# Altium schematic sheet brush_driver.SchDoc: Brush_Driver
size A3; CompanyName: BUPT; DrawnBy: BUPT_HCM; Organization: BUPT_Robot; Revision: A; SheetNumber: 1; SheetTotal: 1; Version: 4.1; LibVersion: 0
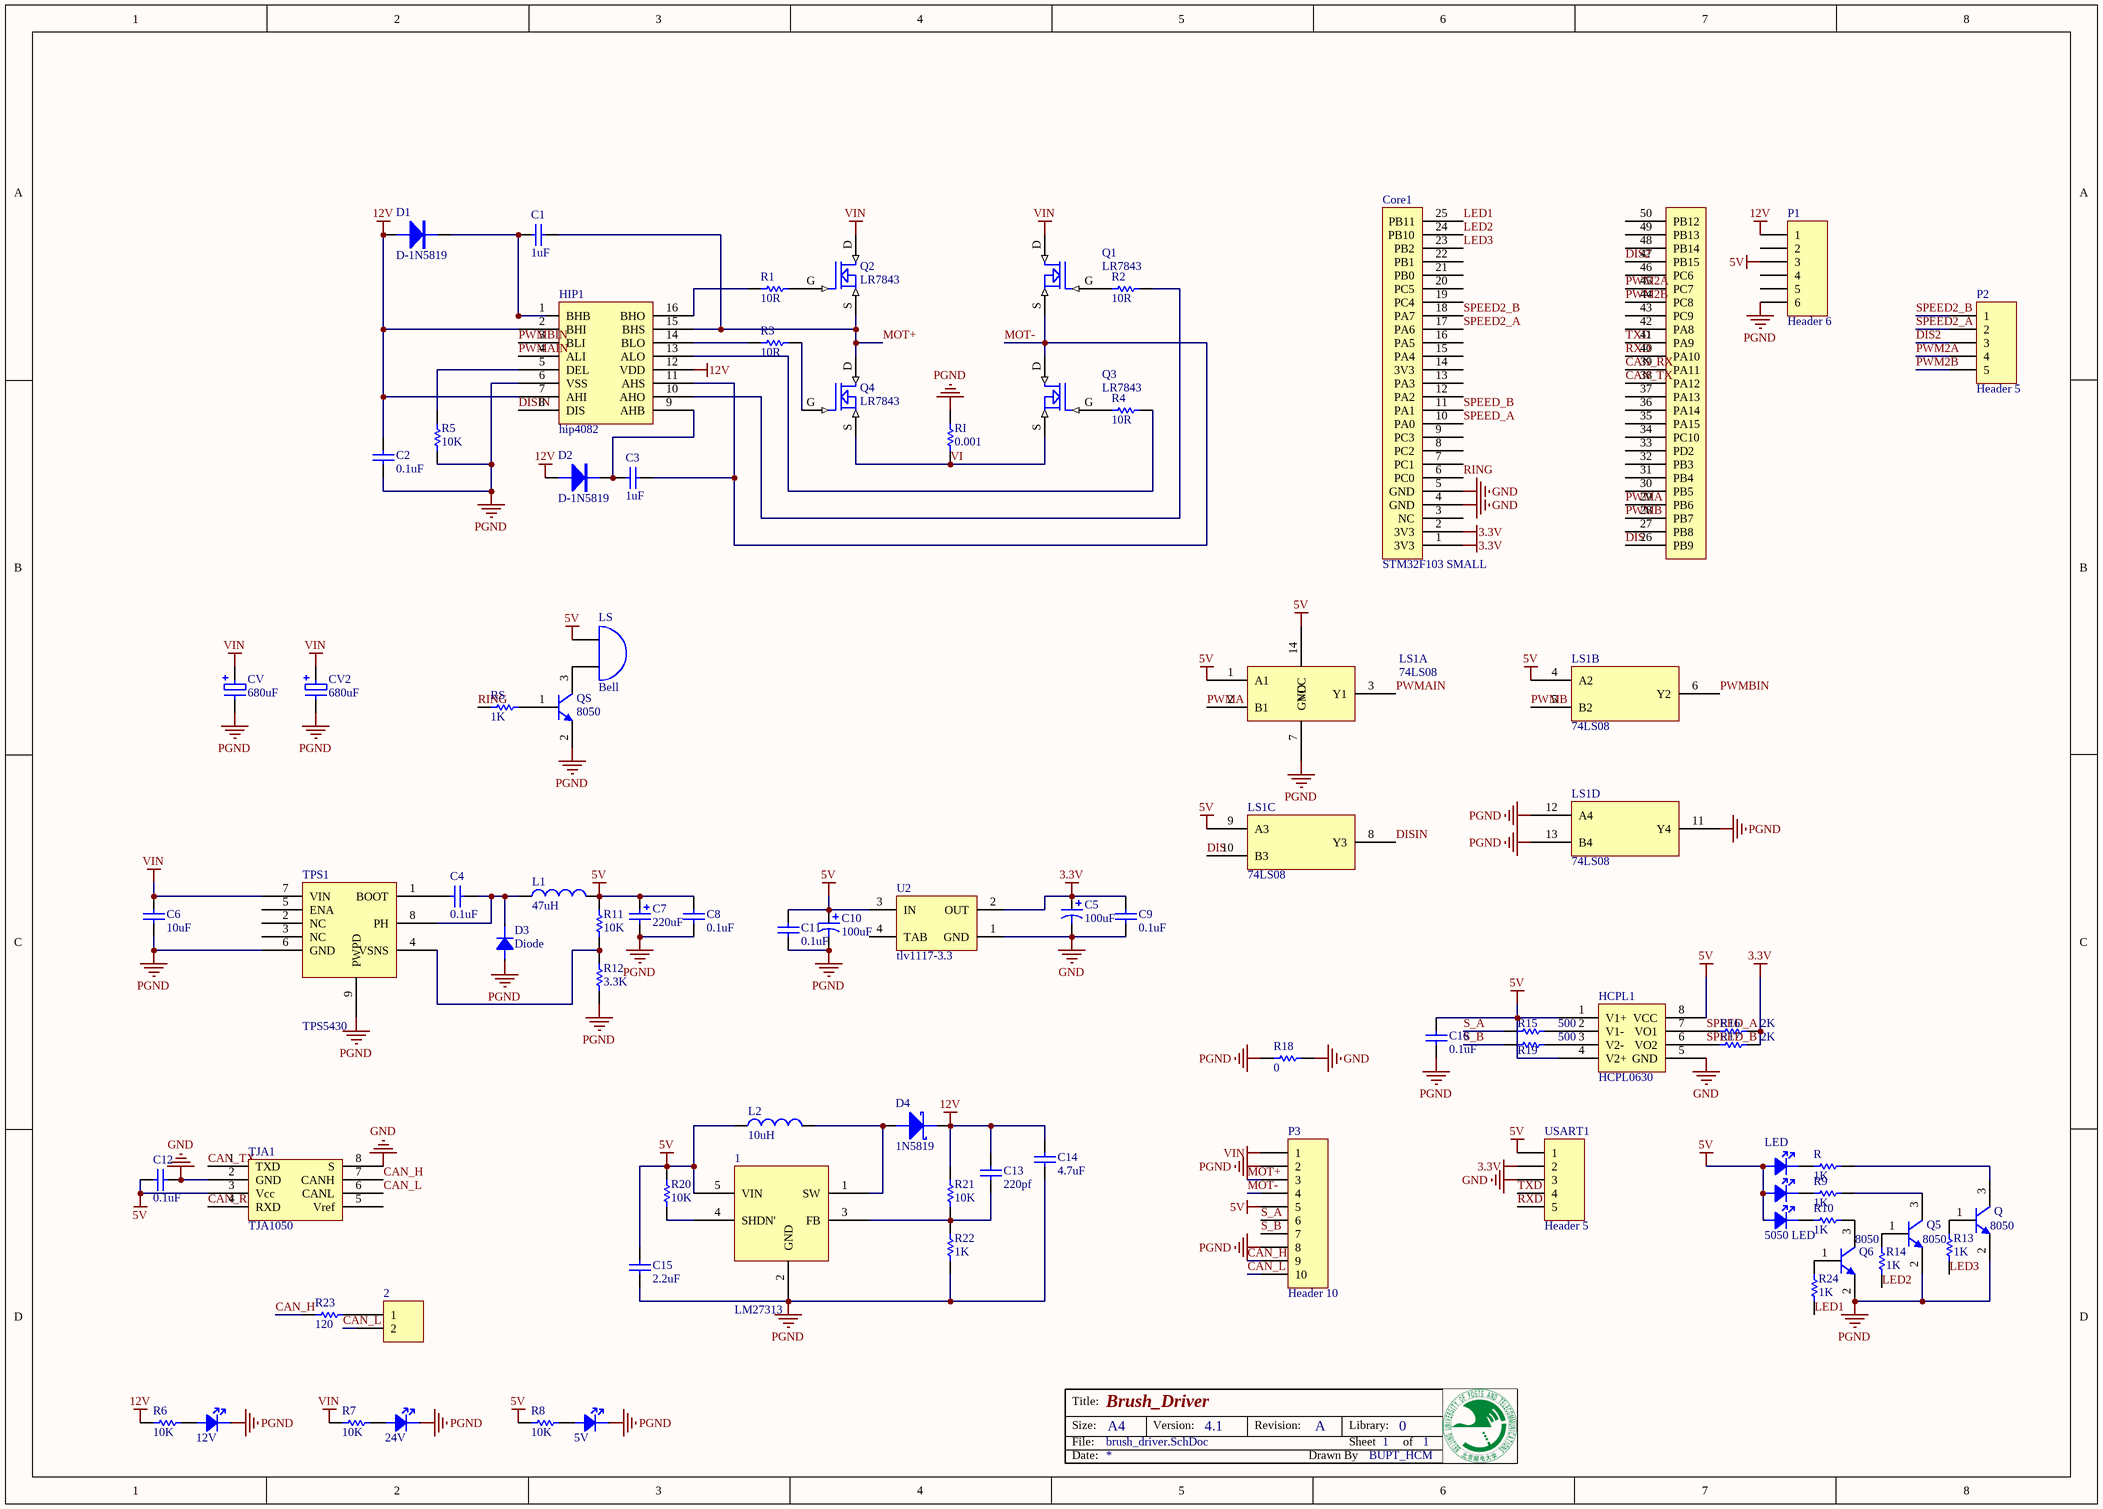
[diagram p0: brush_driver.SchDoc]

## Parts
1  LM27313  [LM27313]
2  Header 2  [SIP2]  (value not drawn)
5V  lED  [0805D]  (value not drawn)
12V  lED  [0805D]  (value not drawn)
24V  lED  [0805D]  (value not drawn)
C1  value 1uF  [CAP-MLCC-0603]  (hidden comment: Cap)
C2  value 0.1uF  [CAP-MLCC-0603]  (hidden comment: Cap)
C3  value 1uF  [CAP-MLCC-0603]  (hidden comment: Cap)
C4  value 0.1uF  [CAP-MLCC-0603]  (hidden comment: Cap)
C5  value 100uF  [6032C]  (hidden comment: Cap Pol3)
C6  value 10uF  [0805C]  (hidden comment: Cap)
C7  value 220uF  [CAP-TAN-7343/CAPD]  (hidden comment: Cap Pol1)
C8  value 0.1uF  [CAP-MLCC-0603]  (hidden comment: Cap)
C9  value 0.1uF  [CAP-MLCC-0603]  (hidden comment: Cap)
C10  value 100uF  [6032C]  (hidden comment: Cap Pol3)
C11  value 0.1uF  [CAP-MLCC-0603]  (hidden comment: Cap)
C12  value 0.1uF  [CAP-MLCC-0603]  (hidden comment: Cap)
C13  value 220pf  [CAP-MLCC-0603]  (hidden comment: Cap)
C14  value 4.7uF  [CAP-MLCC-0603]  (hidden comment: Cap)
C15  value 2.2uF  [CAP-MLCC-0603]  (hidden comment: Cap)
C16  value 0.1uF  [CAP-MLCC-0603]  (hidden comment: Cap)
Core1  STM32F103 SMALL  [STM32F103Small]
CV  680uF  [C_ELE]
CV2  680uF  [C_ELE]
D1  D-1N5819  [0805D]
D2  D-1N5819  [0805D]
D3  Diode  [SS34]
D4  1N5819  [0805D]
HCPL1  HCPL0630  [SOIC8]
HIP1  hip4082  [SOP16]
L1  value 47uH  [CD74]  (hidden comment: Inductor)
L2  value 10uH  [CD52]  (hidden comment: Inductor)
LED  5050 LED  [5050LED]
LS  Bell  [Ring]
LS1  74LS08  [SOJ-14]  (parts A,B,C,D of 4)
P1  Header 6  [HDR1X6]
P2  Header 5  [HDR1X5]
P3  Header 10  [Green 10P]
Q  8050  [SOT-23B_N]
Q1  LR7843  [LR7843]
Q2  LR7843  [LR7843]
Q3  LR7843  [LR7843]
Q4  LR7843  [LR7843]
Q5  8050  [SOT-23B_N]
Q6  8050  [SOT-23B_N]
QS  8050  [SOT-23B_N]
R  value 1K  [RES-0603]  (hidden comment: Res1)
R1  value 10R  [RES-0603]  (hidden comment: Res1)
R2  value 10R  [RES-0603]  (hidden comment: Res1)
R3  value 10R  [RES-0603]  (hidden comment: Res1)
R4  value 10R  [RES-0603]  (hidden comment: Res1)
R5  value 10K  [RES-0603]  (hidden comment: Res1)
R6  value 10K  [RES-0603]  (hidden comment: Res1)
R7  value 10K  [RES-0603]  (hidden comment: Res1)
R8  value 10K  [RES-0603]  (hidden comment: Res1)
R9  value 1K  [RES-0603]  (hidden comment: Res1)
R10  value 1K  [RES-0603]  (hidden comment: Res1)
R11  value 10K  [RES-0603]  (hidden comment: Res1)
R12  value 3.3K  [RES-0603]  (hidden comment: Res1)
R13  value 1K  [RES-0603]  (hidden comment: Res1)
R14  value 1K  [RES-0603]  (hidden comment: Res1)
R15  value 500  [RES-0603]  (hidden comment: Res1)
R16  value 2K  [RES-0603]  (hidden comment: Res1)
R17  value 2K  [RES-0603]  (hidden comment: Res1)
R18  value 0  [RES-0603]  (hidden comment: Res1)
R19  value 500  [RES-0603]  (hidden comment: Res1)
R20  value 10K  [RES-0603]  (hidden comment: Res1)
R21  value 10K  [RES-0603]  (hidden comment: Res1)
R22  value 1K  [RES-0603]  (hidden comment: Res1)
R23  value 120  [RES-0603]  (hidden comment: Res1)
R24  value 1K  [RES-0603]  (hidden comment: Res1)
RI  value 0.001  [2512R]  (hidden comment: Res1)
RS  value 1K  [RES-0603]  (hidden comment: Res1)
TJA1  TJA1050  [TJA1050]
TPS1  TPS5430  [TPS5430]
U2  tlv1117-3.3  [LM1117]
USART1  Header 5  [Green_5P]

## Nets
3.3V: C5.1 C9.1 Core1.1(3V3) Core1.2(3V3) R16.2 R17.2 U2.2(OUT) USART1.2
5V: 1.5(VIN) C7.1 C8.2 C10.1 C11.1 C12.1 C15.2 C16.1 HCPL1.1(V1+) HCPL1.4(V2+) HCPL1.8(VCC) L1.2 L2.1 LED.A1 LED.A2 LED.A3 LS.1(A) LS1.1(A1) LS1.4(A2) LS1.9(A3) LS1.14(VCC) P1.3 P3.5 R8.2 R11.2 R20.1 TJA1.3(Vcc) U2.3(IN) USART1.1
12V: C2.2 C13.2 C14.2 D1.A D2.A D4.K HIP1.2(BHI) HIP1.7(AHI) HIP1.12(VDD) P1.1 R6.2 R21.1
GND: C5.2 C9.2 C12.2 Core1.4(GND) Core1.5(GND) HCPL1.5(GND) R18.2 TJA1.2(GND) TJA1.8(S) U2.1(GND) USART1.3
PGND: 1.2(GND) 5V.K 12V.K 24V.K C2.1 C6.1 C7.2 C8.1 C10.2 C11.2 C14.1 C15.1 C16.2 CV.2 CV2.2 D3.A HIP1.6(VSS) LS1.7(GND) LS1.11(Y4) LS1.12(A4) LS1.13(B4) P1.6 P3.2 P3.8 Q.2(E) Q5.2(E) Q6.2(E) QS.2(E) R5.1 R12.1 R18.1 R22.2 RI.2 TPS1.6(GND) TPS1.9(PWPD)
VIN: C6.2 CV.1 CV2.1 P3.1 Q1.D Q2.D R7.2 TPS1.7(VIN)
CAN_H: P3.9 R23.2 TJA1.7(CANH)
CAN_L: 2.2 P3.10 TJA1.6(CANL)
CAN_RX: Core1.39(PA11) TJA1.4(RXD)
CAN_TX: Core1.38(PA12) TJA1.1(TXD)
DIS: Core1.26(PB9) LS1.10(B3)
DIS2: Core1.47(PB15) P2.3
DISIN: HIP1.8(DIS) LS1.8(Y3)
LED1: Core1.25(PB11) R24.2
LED2: Core1.24(PB10) R14.2
LED3: Core1.23(PB2) R13.2
MOT+: C1.1 HIP1.15(BHS) P3.3 Q2.S Q4.D
MOT-: C3.1 HIP1.11(AHS) P3.4 Q1.S Q3.D
PWM2A: Core1.45(PC7) P2.4
PWM2B: Core1.44(PC8) P2.5
PWMA: Core1.29(PB6) LS1.2(B1)
PWMAIN: HIP1.4(ALI) LS1.3(Y1)
PWMB: Core1.28(PB7) LS1.5(B2)
PWMBIN: HIP1.3(BLI) LS1.6(Y2)
RING: Core1.6(PC0) RS.2
RXD: Core1.40(PA10) USART1.5
S_A: P3.6 R15.1
S_B: P3.7 R19.1
SPEED2_A: Core1.17(PA6) P2.2
SPEED2_B: Core1.18(PA7) P2.1
SPEED_A: Core1.10(PA0) HCPL1.7(VO1) R16.1
SPEED_B: Core1.11(PA1) HCPL1.6(VO2) R17.1
TXD: Core1.41(PA9) USART1.4
VI: Q3.S Q4.S RI.1
Net1_1: 1.1(SW) D4.A L2.2
Net1_3: 1.3(FB) C13.1 R21.2 R22.1
Net1_4: 1.4(SHDN') R20.2
Net2_1: 2.1 R23.1
Net5V_A: 5V.A R8.1
Net12V_A: 12V.A R6.1
Net24V_A: 24V.A R7.1
NetC1_2: C1.2 D1.K HIP1.1(BHB)
NetC3_2: C3.2 D2.K HIP1.9(AHB)
NetC4_1: C4.1 TPS1.1(BOOT)
NetC4_2: C4.2 D3.K L1.1 TPS1.8(PH)
NetHCPL1_2: HCPL1.2(V1-) R15.2
NetHCPL1_3: HCPL1.3(V2-) R19.2
NetHIP1_5: HIP1.5(DEL) R5.2
NetHIP1_10: HIP1.10(AHO) R2.2
NetHIP1_13: HIP1.13(ALO) R4.2
NetHIP1_14: HIP1.14(BLO) R3.1
NetHIP1_16: HIP1.16(BHO) R1.2
NetLED_K1: LED.K1 R.2
NetLED_K2: LED.K2 R9.2
NetLED_K3: LED.K3 R10.2
NetLS_2: LS.2(B) QS.3(C)
NetQ1_G: Q1.G R2.1
NetQ2_G: Q2.G R1.1
NetQ3_G: Q3.G R4.1
NetQ4_G: Q4.G R3.2
NetQ5_1: Q5.1(B) R14.1
NetQ5_3: Q5.3(C) R9.1
NetQ6_1: Q6.1(B) R24.1
NetQ6_3: Q6.3(C) R10.1
NetQ_1: Q.1(B) R13.1
NetQ_3: Q.3(C) R.1
NetQS_1: QS.1(B) RS.1
NetR11_1: R11.1 R12.2 TPS1.4(VSNS)

Not connected (* = marked no-connect by the designer): Core1 3(NC) 7(PC1) 8(PC2) 9(PC3) 12(PA2) 13(PA3) 14(3V3) 15(PA4) 16(PA5) 19(PC4) 20(PC5) 21(PB0) 22(PB1) 27(PB8) 30(PB5) 31(PB4) 32(PB3) 33(PD2) 34(PC10) 35(PA15) 36(PA14) 37(PA13) 42(PA8) 43(PC9) 46(PC6) 48(PB14) 49(PB13) 50(PB12); P1 2 4 5; TJA1 5(Vref); TPS1 2(NC) 3(NC) 5(ENA); U2 4(TAB)

## Notes on the sheet
- Title:
- Size:
- Date:
- File:
- A4
- Version:
- Revision:
- Drawn By
- Sheet
- Library:
- of

## Library data of the parts
2 = Header 2: Header, 2-Pin; LatestRevisionDate: 17-Jul-2002; LatestRevisionNote: Re-released for DXP Platform.; Publisher: Altium Limited
5V 12V 24V = 00-D-LED
C1-C4 C6 C8 C9 C11 C12 C16 = Cap: Capacitor; Published: 8-Jun-2000; LatestRevisionDate: 17-Jul-2002; LatestRevisionNote: Re-released for DXP Platform.; PackageReference: RAD-0.3; Publisher: Altium Limited
C5 C10 = Cap Pol3: Polarized Capacitor (Surface Mount); Published: 8-Jun-2000; LatestRevisionDate: 17-Jul-2002; LatestRevisionNote: Re-released for DXP Platform.; PackageReference: C0805; Publisher: Altium Limited
C7 = Cap Pol1: Polarized Capacitor (Radial); Published: 8-Jun-2000; LatestRevisionDate: 17-Jul-2002; LatestRevisionNote: Re-released for DXP Platform.; PackageReference: RB7.6-15; Publisher: Altium Limited
C13-C15 = Cap_1: Capacitor; Published: 8-Jun-2000; LatestRevisionDate: 17-Jul-2002; LatestRevisionNote: Re-released for DXP Platform.; PackageReference: RAD-0.3; Publisher: Altium Limited
CV CV2 = CAP-ELE: 电解电容; Value: *μF; Published: 8-Jun-2000; LatestRevisionDate: 17-Jul-2002; LatestRevisionNote: Re-released for DXP Platform.; PackageReference: RB7.6-15; Publisher: Altium Limited; PackageDescription: Polarized Capacitor (Radial); 2 Leads
D1 D2 = D-1N5819: Diode
D4 = D-MBRA140T3: MBRA140T3
L1 L2 = Inductor: Code_IEC: 1005; Published: 8-Jun-2000; LatestRevisionDate: 17-Jul-2002; LatestRevisionNote: Re-released for DXP Platform.; PackageReference: 0402-A; Publisher: Altium Limited; Code_JEITA: 0402
LS = Bell: Electrical Bell; Published: 24-Mar-1999; LatestRevisionDate: 17-Jul-2002; LatestRevisionNote: Re-released for DXP Platform.; PackageReference: PIN2; Publisher: Altium Limited
P1 = Header 6: Header, 6-Pin; LatestRevisionDate: 17-Jul-2002; LatestRevisionNote: Re-released for DXP Platform.; Publisher: Altium Limited
P2 USART1 = Header 5: Header, 5-Pin; LatestRevisionDate: 17-Jul-2002; LatestRevisionNote: Re-released for DXP Platform.; Publisher: Altium Limited
P3 = Header 10: Header, 10-Pin; LatestRevisionDate: 17-Jul-2002; LatestRevisionNote: Re-released for DXP Platform.; Publisher: Altium Limited
Q Q5 Q6 QS = QNPN: NPN Bipolar Transistor; Published: 8-Jun-2000; LatestRevisionDate: 29-May-2009; LatestRevisionNote: IPC-7351 Footprint Added.; PackageVersion: Aug-1999; PackageReference: SOT-23B; Publisher: Altium Limited; PackageDescription: 3-Pin SOT-23 Package 0.95 mm Pitch, 2.4 mm Lead Span
R R1-R19 R23 R24 RI RS = Res1: Resistor; Published: 8-Jun-2000; LatestRevisionDate: 17-Jul-2002; LatestRevisionNote: Re-released for DXP Platform.; PackageReference: AXIAL-0.3; Publisher: Altium Limited
R20-R22 = Res1_1: Resistor; Published: 8-Jun-2000; LatestRevisionDate: 17-Jul-2002; LatestRevisionNote: Re-released for DXP Platform.; PackageReference: AXIAL-0.3; Publisher: Altium Limited
TJA1 = TJA1050: CAN总线收发器
U2 = LM1117IMP-5.0: 800mA Low-Dropout Linear Regulator; Manufacturer: National Semiconductor; CompType: LDO IC; PackageTopMarking: XYTT*N06B; PowerWise: N; Published: 4-Dec-2008; DatasheetVersion: Apr-2006; PackageVersion: revB, Apr-2003; PackageReference: MP04A; Publisher: Altium Limited; PackageDescription: Molded SOT-223, 6.50 x 3.56 x 1.6mm Body, 4 Lead, 2.3mm Pitch; PartNumber: LM1117IMP-5.0; RoHS: O; PinCount: 4; DigiKeyPartNumber: LM1117IMP-5.0CT-ND; Code_JEDEC: TO-261-AA; Code_IPC: SOT223-4; ComponentLink1Description: LM1117 Datasheet; ComponentLink1URL: http://www.national.com/ds/LM/LM1117.pdf; ComponentLink2Description: LM1117 Web Page; ComponentLink2URL: http://www.national.com/pf/LM/LM1117.html; ComponentLink3Description: MP04A Package Page; ComponentLink3URL: http://www.national.com/packaging/folders/mp04a.html